# Altium schematic sheet power.SchDoc
size A
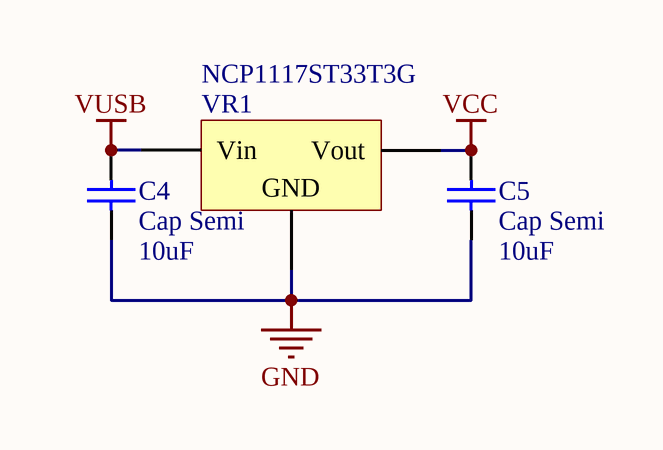
[diagram p0: power.SchDoc]

## Parts
C4  Cap Semi  value 10uF  [CAPC1608L]
C5  Cap Semi  value 10uF  [CAPC1608L]
VR1  NCP1117ST33T3G  [SOT223-4N]

## Nets
GND: C4.1 C5.1 VR1.2(GND)
VCC: C5.2 VR1.3(Vout)
VUSB: C4.2 VR1.1(Vin)

## Library data of the parts
C4 C5 = Cap Semi: Capacitor (Semiconductor SIM Model); Published: 8-Jun-2000; LatestRevisionDate: 29-May-2009; LatestRevisionNote: IPC-7351 Footprint Added.; PackageReference: C1206; Publisher: Altium Limited; PackageDescription: Chip Capacitor
VR1 = Volt Reg: Voltage Regulator; Published: 24-Mar-1999; LatestRevisionDate: 29-May-2009; LatestRevisionNote: IPC-7351 Footprint Added.; PackageReference: D2PAK; Publisher: Altium Limited; PackageDescription: 3-Pin Transistor Outline Package 2.54 mm Pitch, 15.1 mm Lead Span